# EAGLE design untitled (EAGLE 8.3.1)
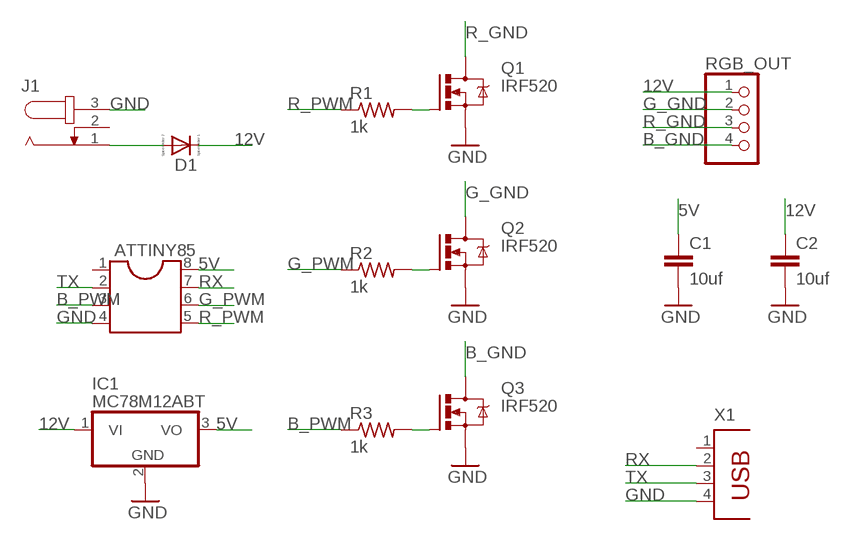
[diagram p0: schematic, sheet 1]

## Parts
ATTINY85  DIL8S  [SOCKET-08]
C1  10uf  C-EU050-045X075  [C050-045X075]
C2  10uf  C-EU050-045X075  [C050-045X075]
D1  DIODE_E-DO35-7  [DIODE_DO35-7]
IC1  MC78M12ABT  [TO220V]
J1  JACK-PLUG0  [SPC4077]
Q1  IRF520  [TO220BV]
Q2  IRF520  [TO220BV]
Q3  IRF520  [TO220BV]
R1  1k  R-US_0207/10  [0207/10]
R2  1k  R-US_0207/10  [0207/10]
R3  1k  R-US_0207/10  [0207/10]
RGB_OUT  PINHD-1X4  [1X04]
X1  PN87520  [PN87520]

## Nets
5V: ATTINY85.8 C1.1 IC1.3(VO)
12V: C2.1 D1.C(A) IC1.1(VI) RGB_OUT.1
B_GND: Q3.D RGB_OUT.4
B_PWM: ATTINY85.3 R3.1
G_GND: Q2.D RGB_OUT.2
G_PWM: ATTINY85.6 R2.1
GND: ATTINY85.4 C1.2 C2.2 IC1.2(GND) J1.3 Q1.S Q2.S Q3.S X1.4
N$1: D1.A(C) J1.1
N$4: Q1.G R1.2
N$5: Q2.G R2.2
N$6: Q3.G R3.2
R_GND: Q1.D RGB_OUT.3
R_PWM: ATTINY85.5 R1.1
RX: ATTINY85.7 X1.2
TX: ATTINY85.2 X1.3
Unconnected: ATTINY85.1 J1.2 X1.1

## Library data of the parts
ATTINY85 = ic-package:DIL8: Dual In Line / Socket
C1 C2 = rcl:C-EU: CAPACITOR, European symbol
D1 = eagle-ltspice:DIODE_E-: Schottky Diode; SPICEMODEL: diode; SPICEPREFIX: D
IC1 = linear:MC78M: 500 mA Positive Voltage Regulators Source: Data sheet <http://www.onsemi.com/pub_link/Collateral/MC78M00-D.PDF>
J1 = con-jack:JACK-PLUG: DC POWER JACK Power Jack, DC, Right Angle, Through Hole, Rated 5A at 16VDC, PC Terminals Distributor: Farnell (www.Farnell.de) Drawing: 84N1161.pdf / 84N1162.pdf Manufacturer: SPC Technology (www.spctechnology.com) Type: SPC4077 / SPC 4078; OC_FARNELL: unknown; OC_NEWARK: unknown
Q1-Q3 = transistor-power:IRF520: HEXFET Power MOSFET
R1-R3 = resistor:R-US_: RESISTOR, American symbol
RGB_OUT = pinhead:PINHD-1X4: PIN HEADER
X1 = con-berg:PN87520: BERG USB connector; OC_FARNELL: unknown; OC_NEWARK: unknown

## Board
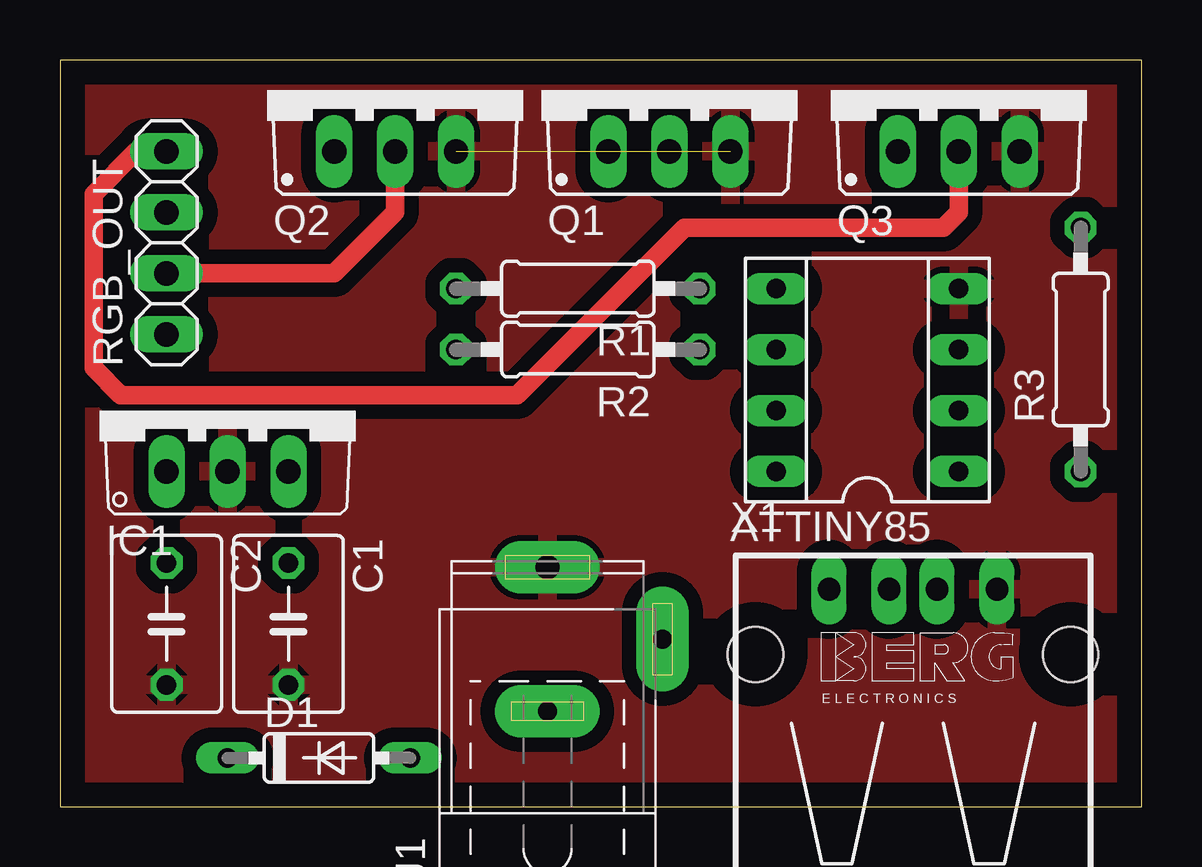
[diagram p1: board, top side]
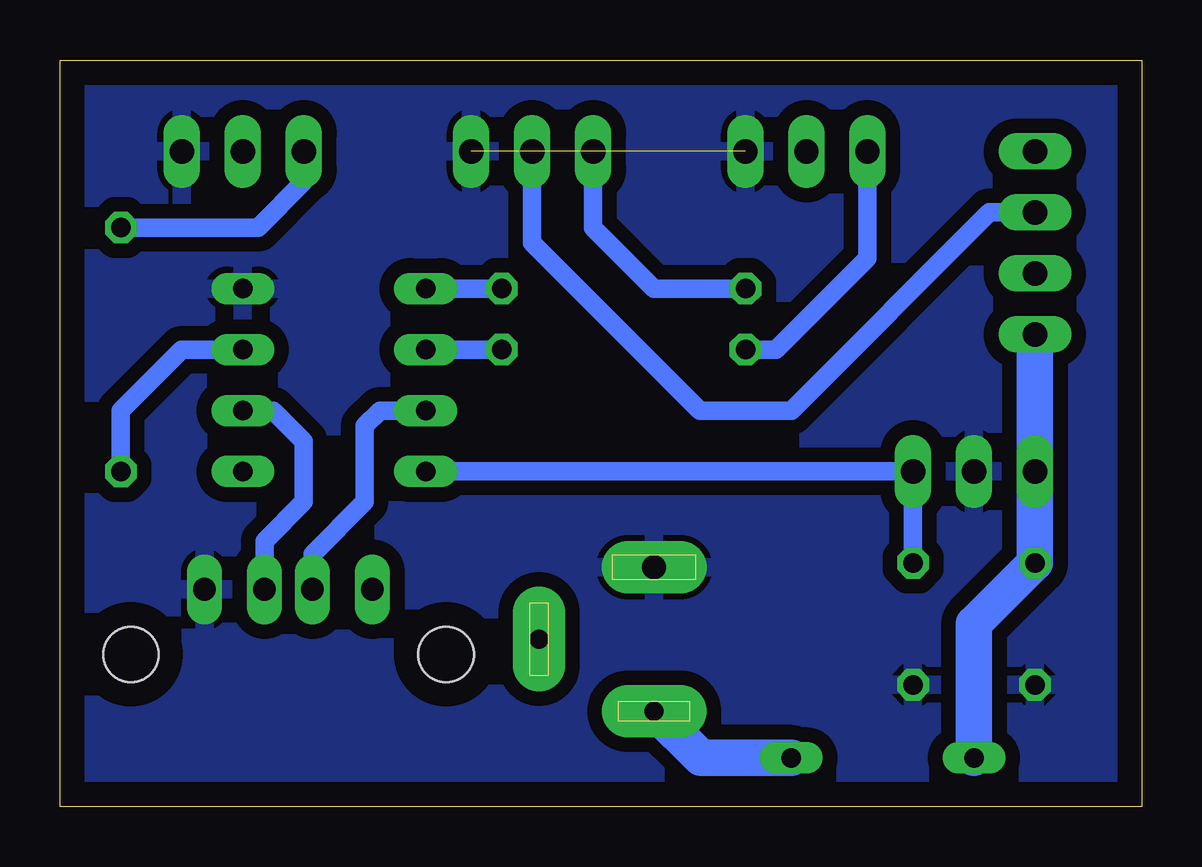
[diagram p2: board, bottom side, seen from below]

Size 45.09 x 31.12 mm. Coordinates in mm from the lower left corner, seen from the top.
Outline: 0,0 45.09,0 45.09,31.12 0,31.11 0,0
Copper layers (1*16): Top 0.035mm / dielectric 1.5mm / Bottom 0.035mm
Design rules "default *": minimum track width 12mil, minimum drill 0.35mm, track to track 24mil, track to pad 24mil, pad to pad 24mil, via to via 24mil, smd to smd 24mil, copper to edge 40mil, drill to drill 24mil, minimum pad ring 10mil, minimum via ring 8mil, stop-mask expansion 4mil, vias tented up to drill 0mil, thermal gap 10mil

### Footprints (pad centres in the part's own frame; a part is rotated, then mirrored left to right if it is on the bottom)
SOCKET-08 = drill 0.813 long: 1 -3.81,-3.81; 2 -1.27,-3.81; 3 1.27,-3.81; 4 3.81,-3.81; 5 3.81,3.81; 6 1.27,3.81; 7 -1.27,3.81; 8 -3.81,3.81
C050-045X075 = drill 0.813 octagon: 1 -2.54,0; 2 2.54,0
DIODE_DO35-7 = drill 0.813 long: A 3.81,0; C -3.81,0
TO220V = drill 1.016 long: 1 -2.54,-2.54; 2 0,-2.54; 3 2.54,-2.54
SPC4077 = drill 0.8 pad 2.184 long: 1 -3,0; 2 0,-4.8 | drill 1 pad 2.184 long: 3 3,0
TO220BV = drill 1.016 long: D 0,-2.54; G -2.54,-2.54; S 2.54,-2.54
0207/10 = drill 0.813 octagon: 1 -5.08,0; 2 5.08,0
1X04 = drill 1.016 long: 1 -3.81,0; 2 -1.27,0; 3 1.27,0; 4 3.81,0
PN87520 = drill 0.95 long: 1 -3.5,2.71; 2 -1,2.71; 3 1,2.71; 4 3.5,2.71 | hole 2.3: -6.57,0; 6.57,0

### Placement (x,y rotation side)
ATTINY85  33.66,17.78 90 top
C1  9.53,7.62 270 top
C2  4.45,7.62 270 top
D1  10.8,2.03 0 top
IC1  6.98,16.51 0 top
J1  20.32,6.99 90 top
Q1  25.4,29.84 0 top
Q2  13.97,29.84 0 top
Q3  37.46,29.84 0 top
R1  21.59,21.59 180 top
R2  21.59,19.05 180 top
R3  42.55,19.05 90 top
RGB_OUT  4.45,23.5 90 top
X1  35.56,6.35 0 top

### Tracks (layer width: path | path; a pad name or v marks a point on that pad's centre or on a via)
5V
  Bottom 0.762: ATTINY85.8 IC1.3 C1.1
12V
  Bottom 1.524: RGB_OUT.1 IC1.1 C2.1 6.98,7.62 D1.C
B_GND
  Top 0.762: RGB_OUT.4 3.18,27.3 1.4,25.53 1.4,18.29 2.54,17.14 19.05,17.14 26.04,24.13 36.83,24.13 37.46,24.77 Q3.D
B_PWM
  Bottom 0.762: ATTINY85.3 40.01,19.05 42.55,16.51 R3.1
G_GND
  Top 0.762: RGB_OUT.2 11.43,22.23 13.97,24.77 Q2.D
G_PWM
  Bottom 0.762: ATTINY85.6 R2.1
GND  (1 unrouted)
  pour Top: 0,31.12 45.09,31.12 45.09,0 0,0
  pour Bottom: 0,31.12 0,0 45.09,0 45.09,31.12 0.64,31.12
N$1
  Bottom 1.524: D1.A 18.37,2.03 J1.1
N$4
  Bottom 0.762: R1.2 20.32,21.59 22.86,24.13 Q1.G
N$5
  Bottom 0.762: R2.2 15.24,19.05 11.43,22.86 Q2.G
N$6
  Bottom 0.762: Q3.G 34.93,26.04 36.83,24.13 R3.2
R_GND
  Bottom 0.762: RGB_OUT.3 6.35,24.77 14.61,16.51 18.41,16.51 25.4,23.5 Q1.D
R_PWM
  Bottom 0.762: R1.1 ATTINY85.5
RX
  Bottom 0.762: X1.2 34.56,10.53 32.38,12.7 32.38,15.88 31.75,16.51 ATTINY85.7
TX
  Bottom 0.762: X1.3 36.56,11.07 34.93,12.7 34.93,15.24 36.2,16.51 ATTINY85.2